# EAGLE schematic carillon-io-board (EAGLE 9.4.2)
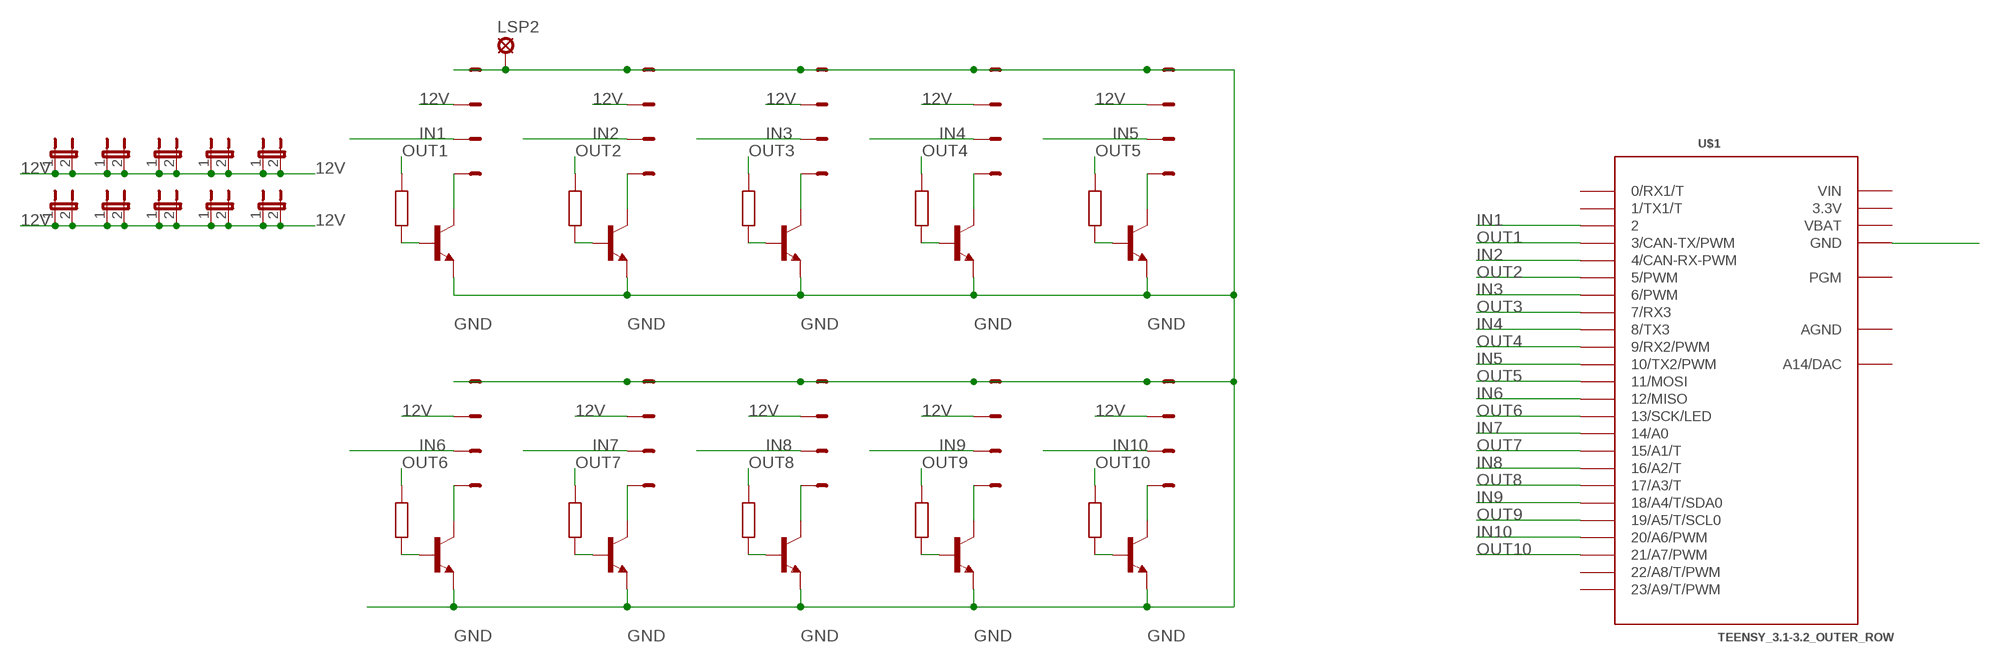
[diagram p0: schematic, sheet 1]

## Parts
J1  22-05-7048-04  [7395-04]
J2  22-05-7048-04  [7395-04]
J3  22-05-7048-04  [7395-04]
J4  22-05-7048-04  [7395-04]
J5  22-05-7048-04  [7395-04]
J6  22-05-7048-04  [7395-04]
J7  22-05-7048-04  [7395-04]
J8  22-05-7048-04  [7395-04]
J9  22-05-7048-04  [7395-04]
J10  22-05-7048-04  [7395-04]
JP1  JP1E  [JP1]
JP2  JP1E  [JP1]
JP3  JP1E  [JP1]
JP4  JP1E  [JP1]
JP5  JP1E  [JP1]
JP6  JP1E  [JP1]
JP7  JP1E  [JP1]
JP8  JP1E  [JP1]
JP9  JP1E  [JP1]
JP10  JP1E  [JP1]
LSP2  LSP10  [LSP10]
R1  R-EU_0207/10  [0207/10]
R3  R-EU_0207/10  [0207/10]
R5  R-EU_0207/10  [0207/10]
R7  R-EU_0207/10  [0207/10]
R9  R-EU_0207/10  [0207/10]
R11  R-EU_0207/10  [0207/10]
R13  R-EU_0207/10  [0207/10]
R15  R-EU_0207/10  [0207/10]
R17  R-EU_0207/10  [0207/10]
R19  R-EU_0207/10  [0207/10]
T1  2N3904  [TO92]
T2  2N3904  [TO92]
T3  2N3904  [TO92]
T4  2N3904  [TO92]
T5  2N3904  [TO92]
T6  2N3904  [TO92]
T7  2N3904  [TO92]
T8  2N3904  [TO92]
T9  2N3904  [TO92]
T10  2N3904  [TO92]
U$1  TEENSY_3.1-3.2_OUTER_ROW  [TEENSY_3.0-3.2&LC_OUTER_ROW]

## Nets
12V: J1.2 J2.2 J3.2 J4.2 J5.2 J6.2 J7.2 J8.2 J9.2 J10.2 JP1.1 JP1.2 JP2.1 JP2.2 JP3.1 JP3.2 JP4.1 JP4.2 JP5.1 JP5.2 JP6.1 JP6.2 JP7.1 JP7.2 JP8.1 JP8.2 JP9.1 JP9.2 JP10.1 JP10.2
GND: J1.1 J2.1 J3.1 J4.1 J5.1 J6.1 J7.1 J8.1 J9.1 J10.1 LSP2.MP T1.3(E) T2.3(E) T3.3(E) T4.3(E) T5.3(E) T6.3(E) T7.3(E) T8.3(E) T9.3(E) T10.3(E)
IN1: J1.3 U$1.2
IN2: J2.3 U$1.4(4/CAN-RX-PWM)
IN3: J3.3 U$1.6(6/PWM)
IN4: J4.3 U$1.8(8/TX3)
IN5: J5.3 U$1.10(10/TX2/PWM)
IN6: J6.3 U$1.12(12/MISO)
IN7: J7.3 U$1.14/A0
IN8: J8.3 U$1.16/A2(16/A2/T)
IN9: J9.3 U$1.18/A4(18/A4/T/SDA0)
IN10: J10.3 U$1.20/A6(20/A6/PWM)
N$1: J1.4 T1.1(C)
N$2: J6.4 T6.1(C)
N$3: J2.4 T2.1(C)
N$4: J3.4 T3.1(C)
N$5: J4.4 T4.1(C)
N$6: J5.4 T5.1(C)
N$7: J7.4 T7.1(C)
N$8: J8.4 T8.1(C)
N$9: J9.4 T9.1(C)
N$10: J10.4 T10.1(C)
N$31: U$1.GND U$1.GND1(GND)
OUT1: R1.1 U$1.3(3/CAN-TX/PWM)
OUT2: R3.1 U$1.5(5/PWM)
OUT3: R5.1 U$1.7(7/RX3)
OUT4: R7.1 U$1.9(9/RX2/PWM)
OUT5: R9.1 U$1.11(11/MOSI)
OUT6: R11.1 U$1.13(13/SCK/LED)
OUT7: R13.1 U$1.15/A1(15/A1/T)
OUT8: R15.1 U$1.17/A3(17/A3/T)
OUT9: R17.1 U$1.19/A5(19/A5/T/SCL0)
OUT10: R19.1 U$1.21/A7(21/A7/PWM)
T1: R1.2 T1.2(B)
T2: R3.2 T2.2(B)
T3: R5.2 T3.2(B)
T4: R7.2 T4.2(B)
T5: R9.2 T5.2(B)
T6: R11.2 T6.2(B)
T7: R13.2 T7.2(B)
T8: R15.2 T8.2(B)
T9: R17.2 T9.2(B)
T10: R19.2 T10.2(B)
Unconnected: U$1.0(0/RX1/T) U$1.1(1/TX1/T) U$1.22/A8(22/A8/T/PWM) U$1.23/A9(23/A9/T/PWM) U$1.PGM U$1.RESET/DAC(A14/DAC)

## Power pins joined to a net without a drawn wire
3.3V: U$1.3.3V U$1.3.3V1(3.3V)
AGND: U$1.AGND
VBAT: U$1.VBAT
VIN: U$1.VIN

## Library data of the parts
J1-J10 = con-molex:22-?-04: CONNECTOR wire to board 2.54 mm (.1 inch) pitch header; MF: MOLEX; OC_FARNELL: unknown; OC_NEWARK: unknown
JP1-JP10 = jumper:JP1E: JUMPER
LSP2 = solpad:LSP10: SOLDER PAD drill 1.0 mm, distributor Buerklin, 12H555
R1 R3 R5 R7 R9 R11 R13 R15 R17 R19 = resistor:R-EU_: RESISTOR, European symbol
T1-T10 = transistor:2N3904: NPN TRANSISTOR
U$1 = Teensy_3_and_LC_Series_Boards_v1.4:TEENSY_3.1-3.2_OUTER_ROW: Footprint for Teensy 3.1 or 3.2 board using all pin connections on the outer perimeter